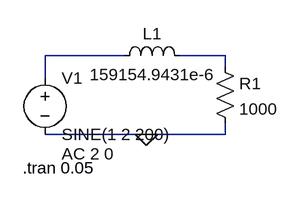
[diagram p0: schematic RL filter.asc]
RL filter.asc, the LTspice schematic file:
Version 4.1
SHEET 1 880 680
WIRE 80 48 -32 48
WIRE 224 48 160 48
WIRE 224 64 224 48
WIRE -32 80 -32 48
WIRE 112 160 -32 160
WIRE 224 160 224 144
WIRE 224 160 112 160
FLAG 112 160 0
SYMBOL res 208 48 R0
SYMATTR InstName R1
SYMATTR Value 1000
SYMBOL ind 64 64 R270
WINDOW 0 32 56 VTop 2
WINDOW 3 5 56 VBottom 2
SYMATTR InstName L1
SYMATTR Value 159154.9431e-6
SYMATTR SpiceLine Rser=1m
SYMBOL voltage -32 64 R0
WINDOW 123 24 124 Left 2
WINDOW 39 0 0 Left 0
SYMATTR InstName V1
SYMATTR Value SINE(1 2 200)
SYMATTR Value2 AC 2 0
TEXT -64 208 Left 2 !.tran 0.05

The netlist it stands for:
* RL filter.asc
R1 N002 0 1000
L1 N001 N002 159154.9431e-6 Rser=1m
V1 N001 0 SINE(1 2 200) AC 2 0
.tran 0.05
.backanno
.end